# Altium schematic sheet USB.SchDoc
size A4
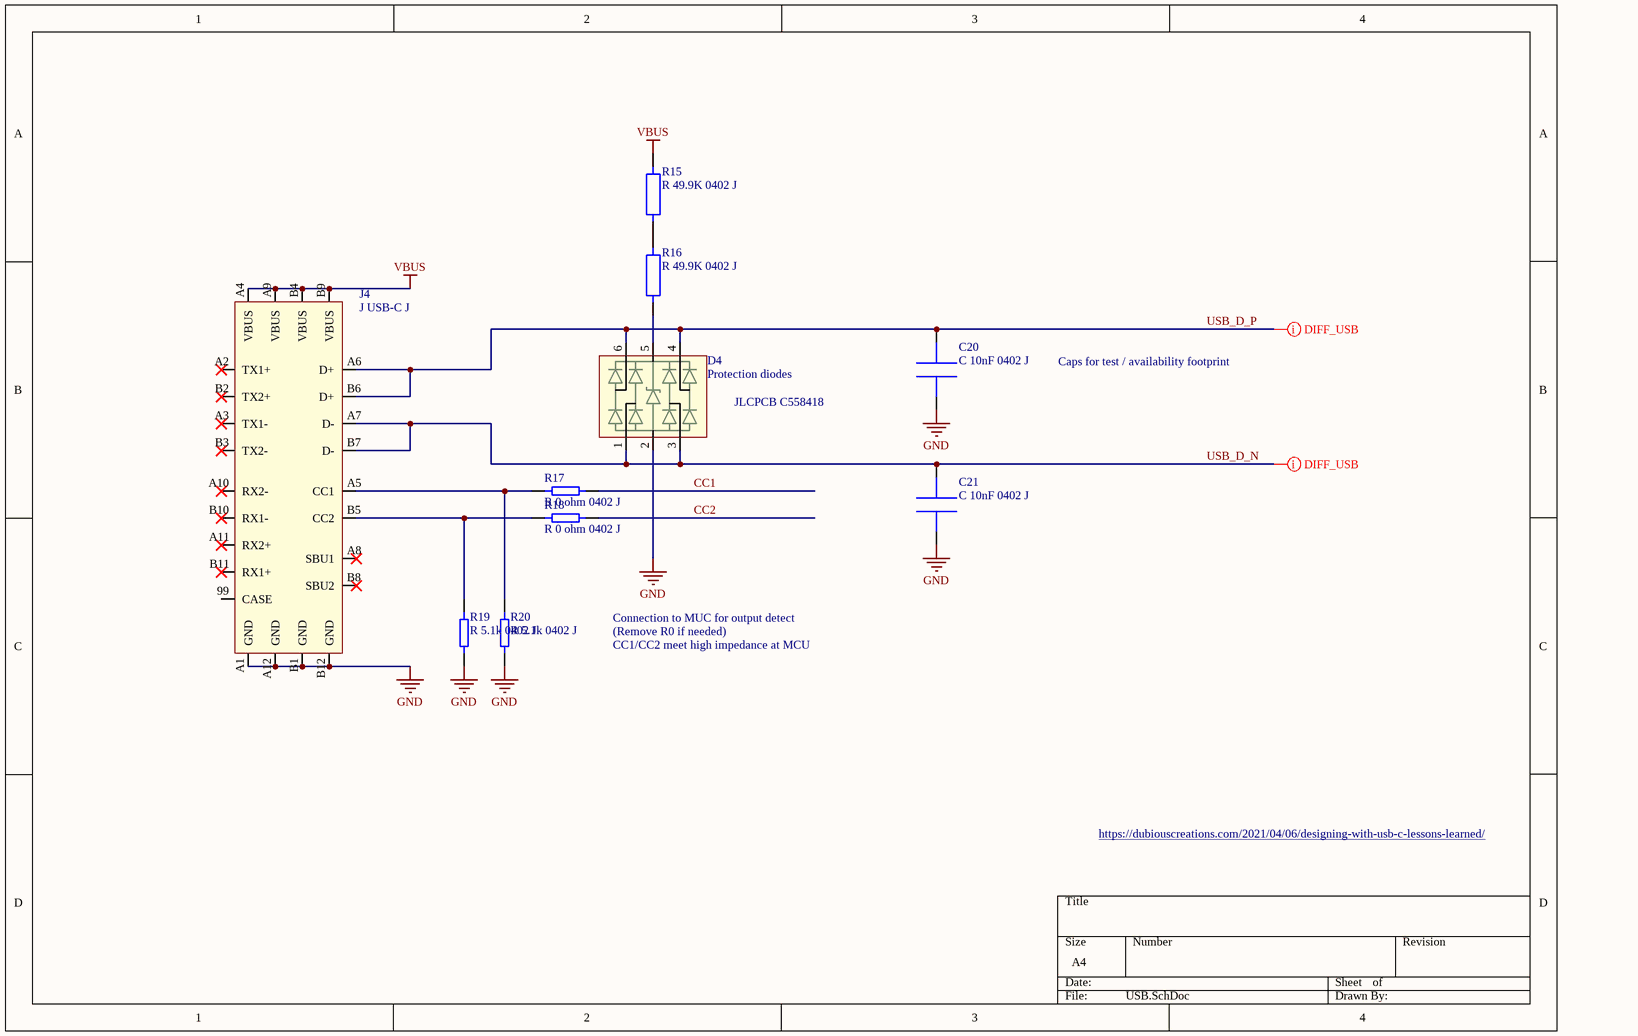
[diagram p0: USB.SchDoc]

## Parts
C20  C 10nF 0402 J  [C0402]
C21  C 10nF 0402 J  [C0402]
D4  Protection diodes  [SOT23-SRV05]
J4  J USB-C J  [MOLEX USB-C 1054500101]
R15  R 49.9K 0402 J  [R0402]
R16  R 49.9K 0402 J  [R0402]
R17  R 0 ohm 0402 J  [R0402]
R18  R 0 ohm 0402 J  [R0402]
R19  R 5.1k 0402 J  [R0402]
R20  R 5.1k 0402 J  [R0402]

## Nets
GND: C20.1 C21.1 D4.2 J4.A1(GND) J4.A12(GND) J4.B1(GND) J4.B12(GND) R19.1 R20.1
VBUS: J4.A4(VBUS) J4.A9(VBUS) J4.B4(VBUS) J4.B9(VBUS) R15.2
CC1: R17.2
CC2: R18.2
USB_D_N: C21.2 D4.1 D4.3 J4.A7(D-) J4.B7(D-)
USB_D_P: C20.2 D4.4 D4.6 J4.A6(D+) J4.B6(D+)
NetD4_5: D4.5 R16.1
NetJ4_A5: J4.A5(CC1) R17.1 R20.2
NetJ4_B5: J4.B5(CC2) R18.1 R19.2
NetR15_1: R15.1 R16.2

Not connected (* = marked no-connect by the designer): J4 99(CASE) A2(TX1+)* A3(TX1-)* A8(SBU1)* A10(RX2-)* A11(RX2+)* B2(TX2+)* B3(TX2-)* B8(SBU2)* B10(RX1-)* B11(RX1+)*

## Layout directives
differential pair: USB_D_N, USB_D_P

## Notes on the sheet
- Caps for test / availability footprint
- JLCPCB C558418
- Connection to MUC for output detect
- (Remove R0 if needed)
- CC1/CC2 meet high impedance at MCU
- https://dubiouscreations.com/2021/04/06/designing-with-usb-c-lessons-learned/

## Library data of the parts
C20 C21 = C 10nF 0402 J: Ceramic capacitor SMD-0402 10nF /50V X7R# K +-10%, Samsung, RoHS CL05B103KB5NNNC; Tolerance: 10%; Voltage Rating: 50V; Dielectric: X7R; Supplier 1: Arrow Electronics; Manufacturer: Samsung; Manufacturer Part Number: CL05B103KB5NNNC; RoHS: Yes; Category: Ceramic Capacitors; Stock 1: 6530000; Pricing 1: 10000=0,00290, 20000=0,00230, 50000=0,00210, 100000=0,00190 (USD); Mount: Surface Mount; Case/Package: 0402; Case Code (Metric): 1005; Case Code (Imperial): 0402; Material: Ceramic; Contact Plating: Tin; Min Operating Temperature: -55°C; Max Operating Temperature: 125°C; Packaging: Tape and Reel; Capacitance: 10nF; Package Quantity: 1; Voltage: 50V; Voltage Rating (DC): 50V; Series: CL; Construction: Flat; Length: 1mm; Width: 0.02inch; Height: 0.5mm; Thickness: 0.022inch; Depth: 0.5mm; Radiation Hardening: No; Lead Free: Lead Free; RoHS Compliant: Yes; ComponentLink1URL: https://datasheet.ciiva.com/15195/getdatasheetpartid-359682-15195636.pdf?src-supplier=Verical; ComponentLink1Description: https://datasheet.ciiva.com/15195/getdatasheetpartid-359682-15195636.pdf?src-supplier=Verical; ComponentLink2URL: https://datasheet.ciiva.com/29198/458761-da-01-en-vs-kondensator-0402-29198432.pdf?src-supplier=Conrad; ComponentLink2Description: https://datasheet.ciiva.com/29198/458761-da-01-en-vs-kondensator-0402-29198432.pdf?src-supplier=Conrad; ComponentLink3URL: https://datasheet.ciiva.com/26309/mlcc-catalogdownload2013-eng-26309005.pdf?src-supplier=Distrelec; ComponentLink3Description: https://datasheet.ciiva.com/26309/mlcc-catalogdownload2013-eng-26309005.pdf?src-supplier=Distrelec; Supplier 2: Digi-Key; Stock 2: 14692768; Pricing 2: 1=0,10000, 10=0,01500, 50=0,00820, 100=0,00670, 500=0,00478, 1000=0,00375, 2500=0,00341, 5000=0,00314 (USD); Supplier 3: Mouser; Stock 3: 2909879; Pricing 3: 1=0,10000, 10=0,00900, 50=0,00900, 100=0,00700, 500=0,00600, 1000=0,00500, 2500=0,00400, 10000=0,00300, 20000=0,00200 (USD); Supplier Part Number 1: CL05B103KB5NNNC; Supplier Part Number 2: 1276-1028-1-ND; Supplier Part Number 3: 187-CL05B103KB5NNNC; JLCPCB: C15195
D4 = D SRV05-4.TCT: SEMTECH - SRV05-4.TCT - ESD Protection Device, TVS, 17.5 V, SOT-23, 6 Pins, 5 V, 300 W; Capacitance: 5pF; Direction: Unidirectional; Reverse Breakdown Voltage: 6V; Number of Elements: 1; Number of Channels: 4; Operating Supply Voltage: 5V; Clamping Voltage: 17.5V; Peak Pulse Power: 300W; Power Line Protection: Yes; Leakage Current: 5uA; Peak Pulse Current: 12A; Test Current: 1mA; Current: 5A; Supplier 1: RSComponents; Manufacturer: Semtech; Manufacturer Part Number: SRV05-4.TCT; RoHS: Yes; Category: TVS Diodes; Stock 1: 425; Pricing 1: 5=1,18100, 25=0,88900, 50=0,77200, 125=0,72400, 250=0,69400 (USD); Mount: Surface Mount; Case/Package: SOT-23; Number of Pins: 6; Min Operating Temperature: -55°C; Max Operating Temperature: 125°C; Packaging: Tape and Reel; Number of Bidirectional Channels: 4; Reverse Standoff Voltage: 5V; Min Breakdown Voltage: 6V; Polarity: Unidirectional; Working Voltage: 5V; ESD Protection: Yes; Max Reverse Leakage Current: 5uA; Max Breakdown Voltage: 6V; Max Power Dissipation: 300W; Voltage Rating (DC): 5V; Breakdown Voltage: 6V; Voltage: 5V; Series: RailClamp®, SR; Clamping Voltage-Max: 17.5V; Length: 2.9mm; Width: 1.6mm; Height: 1.15mm; Depth: 1.6mm; Radiation Hardening: No; REACH SVHC: No SVHC; Lead Free: Lead Free; RoHS Compliant: Yes; ComponentLink1URL: https://datasheet.ciiva.com/18065/getdatasheetpartid-93542-18065216.pdf?src-supplier=Verical; ComponentLink1Description: https://datasheet.ciiva.com/18065/getdatasheetpartid-93542-18065216.pdf?src-supplier=Verical; ComponentLink2URL: https://datasheet.ciiva.com/8029/srv05-4-8029973.pdf?src-supplier=Element14; ComponentLink2Description: https://datasheet.ciiva.com/8029/srv05-4-8029973.pdf?src-supplier=Element14; ComponentLink3URL: https://datasheet.ciiva.com/26787/srv05-4-tct-26787453.pdf?src-supplier=IIIC; ComponentLink3Description: https://datasheet.ciiva.com/26787/srv05-4-tct-26787453.pdf?src-supplier=IIIC; ComponentLink4URL: https://datasheet.ciiva.com/11193/srv05-4-11193639.pdf?src-supplier=Avnet; ComponentLink4Description: https://datasheet.ciiva.com/11193/srv05-4-11193639.pdf?src-supplier=Avnet; ComponentLink5URL: https://datasheet.ciiva.com/16396/srv05-4-16396600.pdf?src-supplier=Future+Electronics; ComponentLink5Description: https://datasheet.ciiva.com/16396/srv05-4-16396600.pdf?src-supplier=Future+Electronics; ComponentLink6URL: https://datasheet.ciiva.com/25955/srv05-4-25955769.pdf?src-supplier=Avnet+Europe; ComponentLink6Description: https://datasheet.ciiva.com/25955/srv05-4-25955769.pdf?src-supplier=Avnet+Europe; ComponentLink7URL: https://datasheet.ciiva.com/338/srv05-4-338860.pdf?src-supplier=Digi-Key; ComponentLink7Description: https://datasheet.ciiva.com/338/srv05-4-338860.pdf?src-supplier=Digi-Key; ComponentLink8URL: https://datasheet.ciiva.com/338/srv05-4-338861.pdf?src-supplier=Digi-Key; ComponentLink8Description: https://datasheet.ciiva.com/338/srv05-4-338861.pdf?src-supplier=Digi-Key; ComponentLink9URL: https://datasheet.ciiva.com/338/srv05-4-338862.pdf?src-supplier=Digi-Key; ComponentLink9Description: https://datasheet.ciiva.com/338/srv05-4-338862.pdf?src-supplier=Digi-Key; Supplier Part Number 1: 6910883; JLCPCB: C13612
J4 = J USB-C J: Conn USB 3.1 Type C F 24 POS Solder RA SMD 24 Terminal 1 Port USB 3.1 T/R 105450-0101; Manufacturer: Molex; Supplier 1: Arrow Electronics; Manufacturer Part Number: 105450-0101; RoHS: Yes; Category: USB Connectors; Stock 1: 1720; Pricing 1: 1=2,36000, 10=1,98100, 25=1,94300, 100=1,88000, 250=1,81800, 500=1,75500, 1000=1,69300 (USD); ComponentLink1URL: http://www.farnell.com/datasheets/2801634.pdf?src-supplier=Farnell; ComponentLink1Description: http://www.farnell.com/datasheets/2801634.pdf?src-supplier=Farnell; ComponentLink2URL: http://www.farnell.com/datasheets/2672741.pdf?src-supplier=Newark; ComponentLink2Description: http://www.farnell.com/datasheets/2672741.pdf?src-supplier=Newark; ComponentLink3URL: https://www.molex.com/pdm_docs/ps/PS-105448-001.pdf?src-supplier=Digi-Key; ComponentLink3Description: https://www.molex.com/pdm_docs/ps/PS-105448-001.pdf?src-supplier=Digi-Key; ComponentLink4URL: https://www.molex.com/pdm_docs/sd/1054500101_sd.pdf?src-supplier=Digi-Key; ComponentLink4Description: https://www.molex.com/pdm_docs/sd/1054500101_sd.pdf?src-supplier=Digi-Key; ComponentLink5URL: http://www.literature.molex.com/SQLImages/kelmscott/Molex/PDF_Images/987651-4081.PDF?src-supplier=Avnet; ComponentLink5Description: http://www.literature.molex.com/SQLImages/kelmscott/Molex/PDF_Images/987651-4081.PDF?src-supplier=Avnet; ComponentLink6URL: http://www.farnell.com/datasheets/2801634.pdf?src-supplier=Newark; ComponentLink6Description: http://www.farnell.com/datasheets/2801634.pdf?src-supplier=Newark; ComponentLink7URL: http://www.farnell.com/datasheets/2801634.pdf?src-supplier=Element14; ComponentLink7Description: http://www.farnell.com/datasheets/2801634.pdf?src-supplier=Element14; ComponentLink8URL: http://www.farnell.com/datasheets/2015275.pdf?src-supplier=Element14; ComponentLink8Description: http://www.farnell.com/datasheets/2015275.pdf?src-supplier=Element14; Supplier 2: RSComponents; Stock 2: 1; Pricing 2: 5=2,95300, 15=2,60200, 65=2,46800, 325=2,04900, 650=1,99600 (USD); Supplier 3: Digi-Key; Stock 3: 42891; Pricing 3: 1=2,68000, 10=2,28300, 100=1,88600 (USD); Supplier 4: Mouser; Stock 4: 76331; Pricing 4: 1=2,65000, 10=2,27000, 50=2,27000, 100=1,87000, 500=1,72000, 1000=1,72000, 1300=1,48000, 2600=1,37000, 3900=1,30000, 9100=1,27000, 10000=1,30000, 24700=1,22000 (USD); JLCPCB: C134092; Supplier Part Number 1: 105450-0101; Supplier Part Number 2: 9209199; Supplier Part Number 3: WM12856CT-ND; Supplier Part Number 4: 538-105450-0101
R15 R16 = R 49.9K 0402 J: Res General Purpose Thick Film 0402 49.9K Ohm 1% 1/16W ±100ppm/°C Molded SMD Paper T/R RC0402FR-0749K9L; Manufacturer: Yageo; Power Rating: 62.5mW; Resistance: 49.9kR; Voltage Rating: 50V; Max Power Dissipation: 63mW; Supplier 1: Arrow Electronics; Manufacturer Part Number: RC0402FR-0749K9L; RoHS: Yes; Category: Chip SMD Resistors; Stock 1: 3590000; Pricing 1: 10000=0,00180, 30000=0,00160, 50000=0,00140, 100000=0,00140 (USD); Case/Package: 0402; Case Code (Imperial): 0402; Case Code (Metric): 1005; Size Code: 0402; Min Operating Temperature: -55°C; Max Operating Temperature: 155°C; Tolerance: 1%; Packaging: Tape and Reel; Termination: SMD/SMT; Resistor Type: Thick Film; Temperature Coefficient: 100ppm/°C; Voltage Rating (DC): 50V; Features: Moisture Resistant; Series: RC; Number of Terminations: 2; Construction: Rectangular; Length: 1mm; Depth: 0.5mm; Military Standard: Not; Lead Free: Lead Free; RoHS Compliant: Yes; ComponentLink1URL: https://datasheet.ciiva.com/17071/pyu-rc0402-51-rohs-l-6-r-17071066.pdf?src-supplier=Future+Electronics; ComponentLink1Description: https://datasheet.ciiva.com/17071/pyu-rc0402-51-rohs-l-6-r-17071066.pdf?src-supplier=Future+Electronics; Supplier 2: RSComponents; Stock 2: 9900; Pricing 2: 10000=0,00200, 50000=0,00200, 100000=0,00200, 200000=0,00200, 400000=0,00200 (GBP); Supplier 3: Digi-Key; Stock 3: 8421822; Pricing 3: 1=0,10000, 10=0,01500, 100=0,00610, 1000=0,00275, 2500=0,00239, 5000=0,00197 (USD); Supplier 4: Mouser; Stock 4: 1268211; Pricing 4: 1=0,10000, 10=0,01800, 50=0,01800, 100=0,00800, 1000=0,00500, 10000=0,00200 (USD); JLCPCB: C137969; Supplier Part Number 2: 1987804; Supplier Part Number 3: 311-49.9KLRDKR-ND; Supplier Part Number 4: 603-RC0402FR-0749K9L; Supplier Part Number 1: RC0402FR-0749K9L
R17 R18 = R 0 ohm 0402 J: RC Series 0402 0.063 W 0 Ohm Jumper Surface Mount Thick Film Chip Resistor RC0402FR-070RL; Manufacturer: Yageo; Resistance: 0R; Tolerance: 1%; Power Rating: 62.5mW; Voltage Rating: 50V; Temperature Coefficient: 200ppm/°C; Max Power Dissipation: 63mW; Supplier 1: Arrow Electronics; Manufacturer Part Number: RC0402FR-070RL; RoHS: Yes; Category: Chip SMD Resistors; Stock 1: 810000; Pricing 1: 10000=0,00120, 30000=0,00110, 50000=0,00100 (USD); Mount: Surface Mount; Case/Package: 0402; Contact Plating: Tin,Matte; Case Code (Imperial): 0402; Case Code (Metric): 1005; Size Code: 0402; Min Operating Temperature: -55°C; Max Operating Temperature: 155°C; Resistor Type: Thick Film; Packaging: Tape and Reel; Termination: SMD/SMT; Features: Moisture Resistant; Series: RC; Number of Terminations: 2; Length: 1mm; Width: 0.5mm; Height: 0.35mm; Radiation Hardening: No; Lead Free: Lead Free; RoHS Compliant: Yes; ComponentLink1URL: https://datasheet.ciiva.com/8896/pyu-rc0402-51-rohs-l-6-8896149.pdf?src-supplier=Avnet; ComponentLink1Description: https://datasheet.ciiva.com/8896/pyu-rc0402-51-rohs-l-6-8896149.pdf?src-supplier=Avnet; ComponentLink2URL: https://datasheet.ciiva.com/16790/pyu-rc0402-51-rohs-l-6-r-16790444.pdf?src-supplier=Future+Electronics; ComponentLink2Description: https://datasheet.ciiva.com/16790/pyu-rc0402-51-rohs-l-6-r-16790444.pdf?src-supplier=Future+Electronics; Supplier 2: Digi-Key; Stock 2: 9382775; Pricing 2: 1=0,10000, 10=0,01200, 25=0,00840, 50=0,00640, 100=0,00480, 250=0,00364, 500=0,00290, 1000=0,00214, 5000=0,00154 (USD); Supplier 3: Mouser; Stock 3: 8133261; Pricing 3: 1=0,10000, 10=0,01400, 50=0,01400, 100=0,00600, 1000=0,00300, 5000=0,00200, 10000=0,00100 (USD); JLCPCB: C106231; Supplier Part Number 1: RC0402FR-070RL; Supplier Part Number 2: 311-0.0LRCT-ND; Supplier Part Number 3: 603-RC0402FR-070RL
R19 R20 = R 5.1k 0402 J: Res Thick Film 1.0 x 0.5 mm 5.1K Ohm 1% 0.063W(1/16W) 100ppm/ C Molded SMD Paper T/R RC0402FR-075K1L; Manufacturer: Yageo; Power Rating: 63mW; Resistance: 5.1kR; Temperature Coefficient: 100ppm/°C; Voltage Rating: 50V; Supplier 1: Arrow Electronics; Manufacturer Part Number: RC0402FR-075K1L; RoHS: Yes; Category: Chip SMD Resistors; Stock 1: 170000; Pricing 1: 10000=0,00180, 30000=0,00160, 50000=0,00140, 100000=0,00140 (USD); Case/Package: 0402; Case Code (Metric): 1005; Case Code (Imperial): 0402; Min Operating Temperature: -55°C; Max Operating Temperature: 155°C; Tolerance: 1%; Technology: THICK FILM; Packaging: Tape and Reel; Package Quantity: 1; Resistor Type: Thick Film; Number of Terminations: 2; Termination: SMD/SMT; Max Power Dissipation: 63mW; Voltage Rating (DC): 50V; Working Voltage: 50V; Features: Moisture Resistant; Series: RC; Resistance Tolerance: 1%; Construction: Rectangular; Length: 1mm; Width: 0.02inch; Height: 0.016inch; Depth: 0.5mm; RoHS Compliant: Yes; REACH SVHC: Unknown; Military Standard: Not; Lead Free: Lead Free; ComponentLink1URL: https://datasheet.ciiva.com/7983/1018594-7983519.pdf?src-supplier=Element14; ComponentLink1Description: https://datasheet.ciiva.com/7983/1018594-7983519.pdf?src-supplier=Element14; ComponentLink2URL: https://datasheet.ciiva.com/46394/1018594-46394936.pdf?src-supplier=Element14; ComponentLink2Description: https://datasheet.ciiva.com/46394/1018594-46394936.pdf?src-supplier=Element14; ComponentLink3URL: https://datasheet.ciiva.com/2453/pyu-r-int-thick-7-2453401.pdf?src-supplier=Digi-Key; ComponentLink3Description: https://datasheet.ciiva.com/2453/pyu-r-int-thick-7-2453401.pdf?src-supplier=Digi-Key; ComponentLink4URL: https://datasheet.ciiva.com/2453/pyu-r-int-thick-7-2453402.pdf?src-supplier=Digi-Key; ComponentLink4Description: https://datasheet.ciiva.com/2453/pyu-r-int-thick-7-2453402.pdf?src-supplier=Digi-Key; ComponentLink5URL: https://datasheet.ciiva.com/2453/pyu-r-int-thick-7-2453400.pdf?src-supplier=Digi-Key; ComponentLink5Description: https://datasheet.ciiva.com/2453/pyu-r-int-thick-7-2453400.pdf?src-supplier=Digi-Key; ComponentLink6URL: https://datasheet.ciiva.com/12558/pyu-rc0402-51-rohs-l-6-r-8721-12558460.pdf?src-supplier=Mouser; ComponentLink6Description: https://datasheet.ciiva.com/12558/pyu-rc0402-51-rohs-l-6-r-8721-12558460.pdf?src-supplier=Mouser; ComponentLink7URL: https://datasheet.ciiva.com/16744/pyu-rc0402-51-rohs-l-6-r-16744283.pdf?src-supplier=Future+Electronics; ComponentLink7Description: https://datasheet.ciiva.com/16744/pyu-rc0402-51-rohs-l-6-r-16744283.pdf?src-supplier=Future+Electronics; ComponentLink8URL: https://datasheet.ciiva.com/15189/getdatasheetpartid-323636-15189493.pdf?src-supplier=Verical; ComponentLink8Description: https://datasheet.ciiva.com/15189/getdatasheetpartid-323636-15189493.pdf?src-supplier=Verical; Supplier 2: RSComponents; Stock 2: 17100; Pricing 2: 10000=0,00100 (GBP); Supplier 3: Mouser; Stock 3: 769920; Pricing 3: 1=0,10000, 10=0,01200, 50=0,01200, 100=0,00500, 1000=0,00300, 2500=0,00200, 10000=0,00100 (USD); JLCPCB: C105872; Supplier Part Number 1: RC0402FR-075K1L; Supplier Part Number 2: 1987834; Supplier Part Number 3: 603-RC0402FR-075K1L